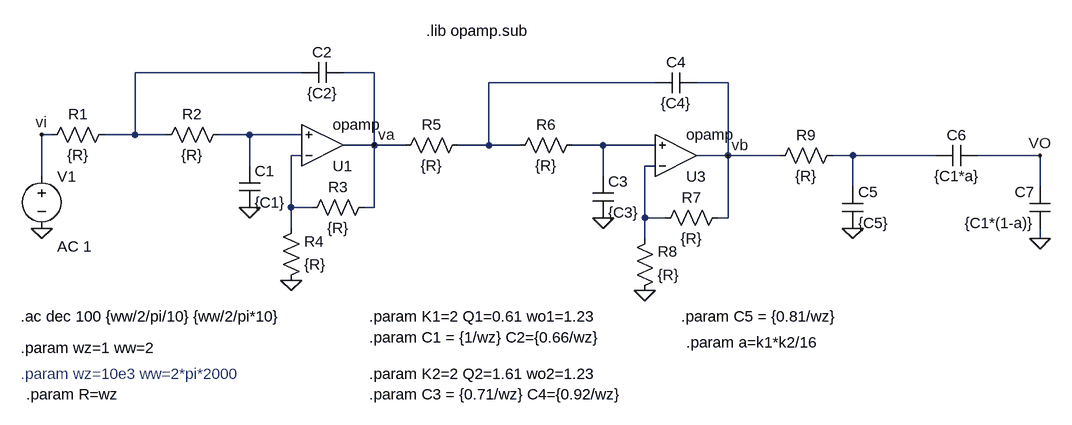
[diagram p0: schematic Ej2.asc]
Ej2.asc, the LTspice schematic file:
Version 4
SHEET 1 1604 680
WIRE 96 16 -160 16
WIRE 208 16 160 16
WIRE 640 32 384 32
WIRE 752 32 704 32
WIRE -288 112 -304 112
WIRE -160 112 -160 16
WIRE -160 112 -208 112
WIRE -112 112 -160 112
WIRE 16 112 -32 112
WIRE 96 112 16 112
WIRE 208 128 208 16
WIRE 208 128 160 128
WIRE 256 128 208 128
WIRE 384 128 384 32
WIRE 384 128 336 128
WIRE 432 128 384 128
WIRE 560 128 512 128
WIRE 640 128 560 128
WIRE 96 144 80 144
WIRE 752 144 752 32
WIRE 752 144 704 144
WIRE 832 144 752 144
WIRE 944 144 912 144
WIRE 1072 144 944 144
WIRE 1232 144 1136 144
WIRE 16 160 16 112
WIRE 640 160 624 160
WIRE -304 176 -304 112
WIRE 560 176 560 128
WIRE 944 192 944 144
WIRE 1232 192 1232 144
WIRE 80 224 80 144
WIRE 112 224 80 224
WIRE 208 224 208 128
WIRE 208 224 192 224
WIRE 624 240 624 160
WIRE 656 240 624 240
WIRE 752 240 752 144
WIRE 752 240 736 240
WIRE 80 256 80 224
WIRE 624 272 624 240
WIRE 1232 272 1232 256
FLAG 16 224 0
FLAG 80 336 0
FLAG -304 256 0
FLAG 560 240 0
FLAG 624 352 0
FLAG -304 112 vi
FLAG 208 128 va
FLAG 944 256 0
FLAG 752 144 vb
FLAG 1232 272 0
FLAG 1232 144 VO
SYMBOL res -192 96 R90
WINDOW 0 0 56 VBottom 2
WINDOW 3 32 56 VTop 2
SYMATTR InstName R1
SYMATTR Value {R}
SYMBOL res -16 96 R90
WINDOW 0 0 56 VBottom 2
WINDOW 3 32 56 VTop 2
SYMATTR InstName R2
SYMATTR Value {R}
SYMBOL res 208 208 R90
WINDOW 0 0 56 VBottom 2
WINDOW 3 32 56 VTop 2
SYMATTR InstName R3
SYMATTR Value {R}
SYMBOL res 64 352 M180
WINDOW 0 36 76 Left 2
WINDOW 3 36 40 Left 2
SYMATTR InstName R4
SYMATTR Value {R}
SYMBOL cap 0 160 R0
SYMATTR InstName C1
SYMATTR Value {C1}
SYMBOL OpAmps\\opamp 128 192 M180
SYMATTR InstName U1
SYMBOL cap 160 0 R90
WINDOW 0 0 32 VBottom 2
WINDOW 3 32 32 VTop 2
SYMATTR InstName C2
SYMATTR Value {C2}
SYMBOL res 352 112 R90
WINDOW 0 0 56 VBottom 2
WINDOW 3 32 56 VTop 2
SYMATTR InstName R5
SYMATTR Value {R}
SYMBOL res 528 112 R90
WINDOW 0 0 56 VBottom 2
WINDOW 3 32 56 VTop 2
SYMATTR InstName R6
SYMATTR Value {R}
SYMBOL res 752 224 R90
WINDOW 0 0 56 VBottom 2
WINDOW 3 32 56 VTop 2
SYMATTR InstName R7
SYMATTR Value {R}
SYMBOL res 608 368 M180
WINDOW 0 36 76 Left 2
WINDOW 3 36 40 Left 2
SYMATTR InstName R8
SYMATTR Value {R}
SYMBOL cap 544 176 R0
SYMATTR InstName C3
SYMATTR Value {C3}
SYMBOL OpAmps\\opamp 672 208 M180
SYMATTR InstName U3
SYMBOL cap 704 16 R90
WINDOW 0 0 32 VBottom 2
WINDOW 3 32 32 VTop 2
SYMATTR InstName C4
SYMATTR Value {C4}
SYMBOL res 928 128 R90
WINDOW 0 0 56 VBottom 2
WINDOW 3 32 56 VTop 2
SYMATTR InstName R9
SYMATTR Value {R}
SYMBOL cap 928 192 R0
SYMATTR InstName C5
SYMATTR Value {C5}
SYMBOL voltage -304 160 R0
WINDOW 123 24 124 Left 2
WINDOW 39 0 0 Left 0
SYMATTR Value2 AC 1
SYMATTR InstName V1
SYMATTR Value ""
SYMBOL cap 1136 128 R90
WINDOW 0 0 32 VBottom 2
WINDOW 3 32 32 VTop 2
SYMATTR InstName C6
SYMATTR Value {C1*a}
SYMBOL cap 1248 256 R180
WINDOW 0 24 56 Left 2
WINDOW 3 24 8 Left 2
SYMATTR InstName C7
SYMATTR Value {C1*(1-a)}
TEXT 288 -48 Left 2 !.lib opamp.sub
TEXT -336 392 Left 2 !.ac dec 100 {ww/2/pi/10} {ww/2/pi*10}
TEXT 200 392 Left 2 !.param K1=2 Q1=0.61 wo1=1.23
TEXT 200 424 Left 2 !.param C1 = {1/wz} C2={0.66/wz}
TEXT 200 480 Left 2 !.param K2=2 Q2=1.61 wo2=1.23
TEXT 200 512 Left 2 !.param C3 = {0.71/wz} C4={0.92/wz}
TEXT -336 480 Left 2 ;.param wz=10e3 ww=2*pi*2000
TEXT -328 512 Left 2 !.param R=wz
TEXT -336 440 Left 2 !.param wz=1 ww=2
TEXT 680 392 Left 2 !.param C5 = {0.81/wz}
TEXT 688 432 Left 2 !.param a=k1*k2/16

The netlist it stands for:
* Ej2.asc
R1 N001 vi {R}
R2 N003 N001 {R}
R3 va N005 {R}
R4 0 N005 {R}
C1 N003 0 {C1}
XU1 N005 N003 va opamp Aol=100K GBW=10Meg  ; pins invin noninvin out
C2 va N001 {C2}
R5 N002 va {R}
R6 N004 N002 {R}
R7 vb N007 {R}
R8 0 N007 {R}
C3 N004 0 {C3}
XU3 N007 N004 vb opamp Aol=100K GBW=10Meg  ; pins invin noninvin out
C4 vb N002 {C4}
R9 N006 vb {R}
C5 N006 0 {C5}
V1 vi 0 AC 1
C6 VO N006 {C1*a}
C7 0 VO {C1*(1-a)}
.lib opamp.sub
.ac dec 100 {ww/2/pi/10} {ww/2/pi*10}
.param K1=2 Q1=0.61 wo1=1.23
.param C1 = {1/wz} C2={0.66/wz}
.param K2=2 Q2=1.61 wo2=1.23
.param C3 = {0.71/wz} C4={0.92/wz}
* .param wz=10e3 ww=2*pi*2000
.param R=wz
.param wz=1 ww=2
.param C5 = {0.81/wz}
.param a=k1*k2/16
.backanno
.end

* Results of the author's LTspice run, read from the files saved beside the schematic
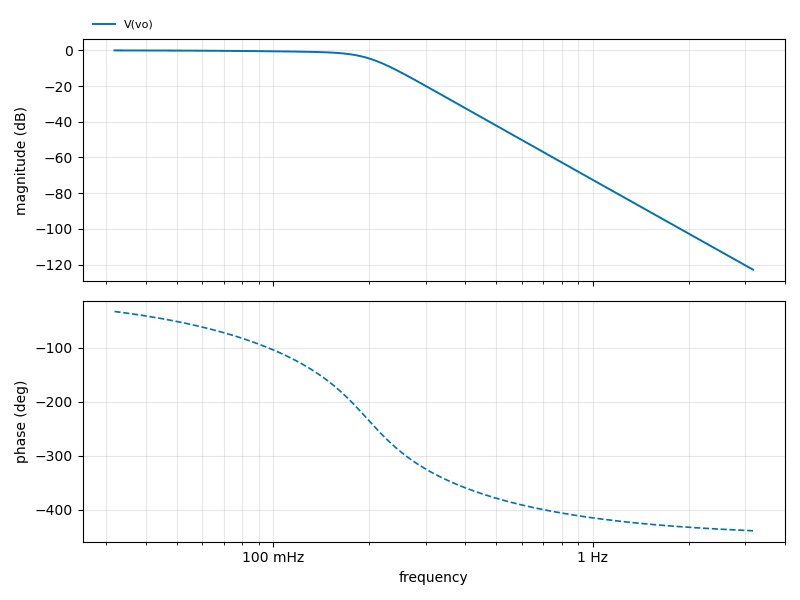
[diagram p1: AC Analysis of Ej2.asc, plotted from the saved traces]
* AC Analysis, 1 run:
*   V(vo): -0.07 dB at 31.83 mHz, -122.82 dB at 3.183 Hz, peak -0.07 dB at 31.83 mHz, 3 dB below the peak at 185.5 mHz